# EAGLE design Triac3+ZeroCrossDetector_Module (EAGLE 9.6.2)
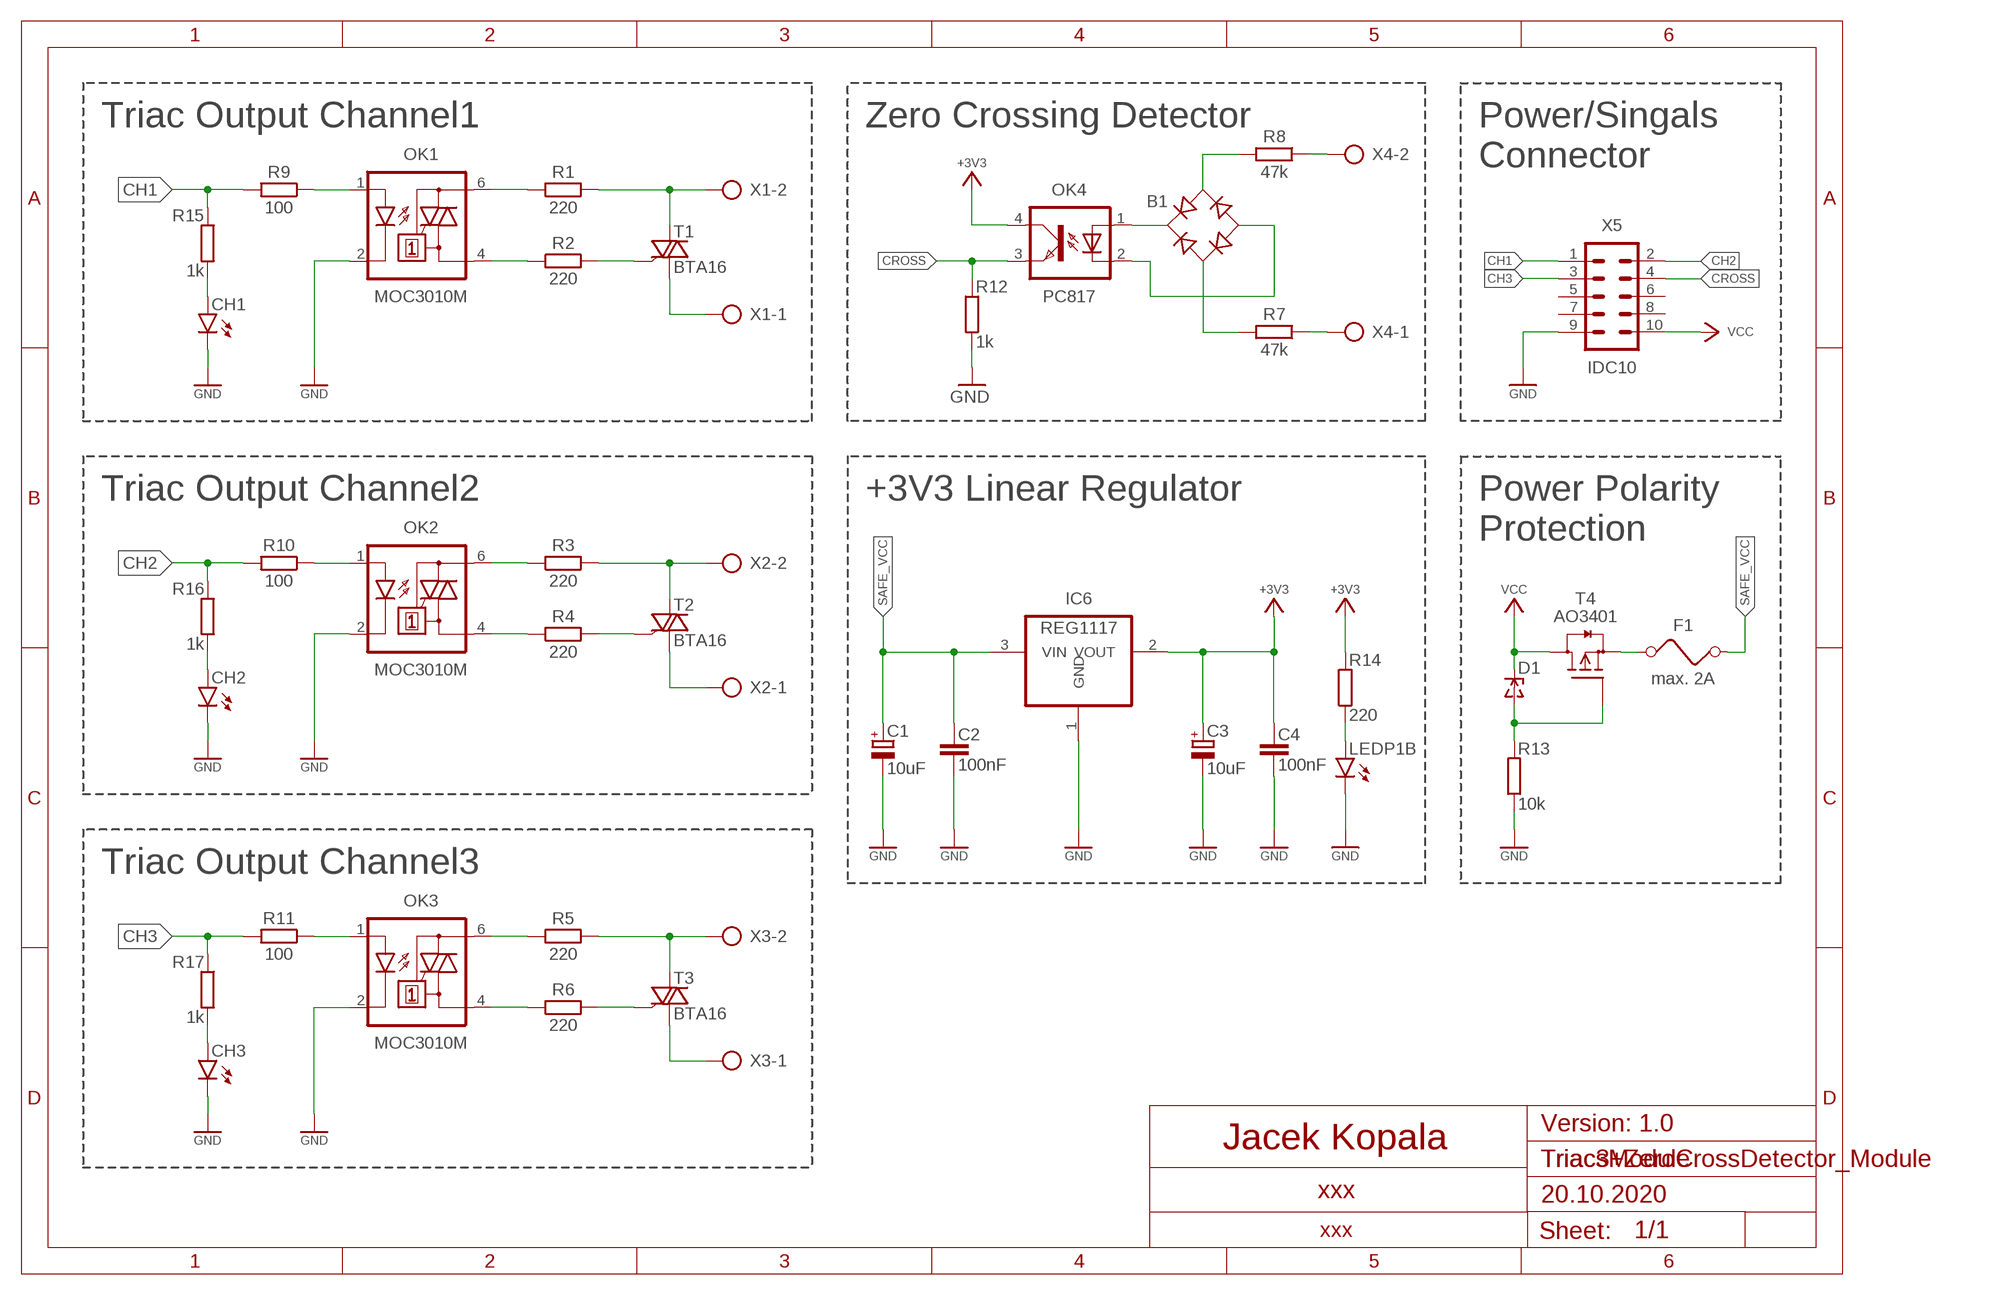
[diagram p0: schematic, sheet 1]

## Parts
B1  RB1A  [RB1A]
C1  10uF  CPOL-EU153CLV-0405  [153CLV-0405]
C2  100nF  C-EUC0805  [C0805]
C3  10uF  CPOL-EU153CLV-0405  [153CLV-0405]
C4  100nF  C-EUC0805  [C0805]
CH1  LEDCHIPLED_0805  [CHIPLED_0805]
CH2  LEDCHIPLED_0805  [CHIPLED_0805]
CH3  LEDCHIPLED_0805  [CHIPLED_0805]
D1  ZENERSOD-323F  [SOD-323F]
F1  max. 2A  FUSEB  [0805]
IC6  REG1117  [SOT223]
LEDP1  LSG-T676  [WL-SFCW-0603]
OK1  MOC3010M  [DIL06]
OK2  MOC3010M  [DIL06]
OK3  MOC3010M  [DIL06]
OK4  PC817  [DIL04]
R1  220  R-EU_0204/7  [0204/7]
R2  220  R-EU_0204/7  [0204/7]
R3  220  R-EU_0204/7  [0204/7]
R4  220  R-EU_0204/7  [0204/7]
R5  220  R-EU_0204/7  [0204/7]
R6  220  R-EU_0204/7  [0204/7]
R7  47k  R-EU_0207/10  [0207/10]
R8  47k  R-EU_0207/10  [0207/10]
R9  100  R-EU_R0805  [R0805]
R10  100  R-EU_R0805  [R0805]
R11  100  R-EU_R0805  [R0805]
R12  1k  R-EU_R0805  [R0805]
R13  10k  R-EU_R0805  [R0805]
R14  220  R-EU_R0805  [R0805]
R15  1k  R-EU_R0805  [R0805]
R16  1k  R-EU_R0805  [R0805]
R17  1k  R-EU_R0805  [R0805]
T1  BTA16  BTA16-V  [TO220BV]
T2  BTA16  BTA16-V  [TO220BV]
T3  BTA16  BTA16-V  [TO220BV]
T4  AO3401  BSS84LT1  [SOT23]
X1  TERMINAL7.5  [TERMINAL7.5]
X2  TERMINAL7.5  [TERMINAL7.5]
X3  TERMINAL7.5  [TERMINAL7.5]
X4  TERMINAL7.5  [TERMINAL7.5]
X5  IDC10  ML10  [ML10]

## Nets
+3V3: C3.+ C4.1 IC6.2(VOUT) OK4.4(COL) R14.2
AC: R1.2 T1.T2(A2) X1.2
AC1: R3.2 T2.T2(A2) X2.2
AC2: R5.2 T3.T2(A2) X3.2
CH1: R9.2 R15.1 X5.1
CH2: R10.2 R16.1 X5.2
CH3: R11.2 R17.1 X5.3
CROSS: OK4.3(EMIT) R12.2 X5.4
GND: C1.- C2.2 C3.- C4.2 CH1.C CH2.C CH3.C IC6.1(GND) LEDP1.P$3(B:C) OK1.2(C) OK2.2(C) OK3.2(C) R12.1 R13.1 X5.9
N$1: B1.AC2 R7.2
N$2: B1.AC1 R8.2
N$3: B1.- OK4.2(C)
N$4: B1.+ OK4.1(A)
N$5: D1.A R13.2 T4.1(G)
N$6: F1.1 T4.2(S)
N$7: R2.2 T1.G
N$8: OK1.1(A) R9.1
N$9: OK1.6(A2) R1.1
N$10: CH1.A R15.2
N$11: T1.T1(A1) X1.1
N$12: OK1.4(A1) R2.1
N$13: CH2.A R16.2
N$14: OK2.1(A) R10.1
N$15: OK2.6(A2) R3.1
N$16: R4.2 T2.G
N$17: T2.T1(A1) X2.1
N$18: OK2.4(A1) R4.1
N$19: CH3.A R17.2
N$20: OK3.1(A) R11.1
N$21: OK3.6(A2) R5.1
N$22: R6.2 T3.G
N$23: T3.T1(A1) X3.1
N$24: OK3.4(A1) R6.1
N$26: R8.1 X4.2
N$27: R7.1 X4.1
N$36: LEDP1.P$4(B:A) R14.1
SAFE_VCC: C1.+ C2.1 F1.2 IC6.3(VIN)
VCC: D1.C T4.3(D) X5.10
Unconnected: LEDP1.P$1(A:C) LEDP1.P$2(A:A) X5.5 X5.6 X5.7 X5.8

## Notes on the sheet
- Triac Output Channel1 | Zero Crossing Detector
- Power/Singals
  Connector
- Triac Output Channel2 | +3V3 Linear Regulator
- Power Polarity
  Protection
- Triac Output Channel3
- Jacek Kopala | Version: 1.0
- TriacsModule
- xxx
- 20.10.2020
- xxx

## Library data of the parts
B1 = rectifier:RB1A: RECTIFIER 1 A
C1 C3 = rcl:CPOL-EU: POLARIZED CAPACITOR, European symbol; SPICEPREFIX: C
C2 C4 = rcl:C-EU: CAPACITOR, European symbol; SPICEPREFIX: C
CH1-CH3 = led:LED: LED OSRAM: - CHIPLED LG R971, LG N971, LY N971, LG Q971, LY Q971, LO R971, LY R971 LH N974, LH R974 LS Q976, LO Q976, LY Q976 LO Q996 - Hyper CHIPLED LW Q18S LB Q993, LB Q99A, LB R99A - SideLED LS A670, LO A670, LY A670, LG A670, LP A670 LB A673, LV A673, LT A673, LW A673 LH A674 LY A675 LS A676, LA A676, LO A676, LY A676, LW A676 LS A679, LY A679, LG A679 - Hyper Micro SIDELED® LS Y876, LA Y876, LO Y876, LY Y876 LT Y87S - SmartLED LW L88C, LW L88S LB L89C, LB L89S, LG L890 LS L89K, LO L89K, LY L89K LS L896, LA L896, LO L896, LY L896 - TOPLED LS T670, LO T670, LY T670, LG T670, LP T670 LSG T670, LSP T670, LSY T670, LOP T670, LYG T670 LG T671, LOG T671, LSG T671 LB T673, LV T673, LT T673, LW T673 LH T674 LS T676, LA T676, LO T676, LY T676, LB T676, LH T676, LSB T676, LW T676 LB T67C, LV T67C, LT T67C, LS T67K, LO T67K, LY T67K, LW E67C LS E67B, LA E67B, LO E67B, LY E67B, LB E67C, LV E67C, LT E67C LW T67C LS T679, LY T679, LG T679 LS T770, LO T770, LY T770, LG T770, LP T770 LB T773, LV T773, LT T773, LW T773 LH T774 LS E675, LA E675, LY E675, LS T675 LS T776, LA T776, LO T776, LY T776, LB T776 LHGB T686 LT T68C, LB T68C - Hyper Mini TOPLED® LB M676 - Mini TOPLED Santana® LG M470 LS M47K, LO M47K, LY M47K Source: http://www.osram.convergy.de LUXEON: - LUMILED® LXK2-PW12-R00, LXK2-PW12-S00, LXK2-PW14-U00, LXK2-PW14-V00 LXK2-PM12-R00, LXK2-PM12-S00, LXK2-PM14-U00 LXK2-PE12-Q00, LXK2-PE12-R00, LXK2-PE12-S00, LXK2-PE14-T00, LXK2-PE14-U00 LXK2-PB12-K00, LXK2-PB12-L00, LXK2-PB12-M00, LXK2-PB14-N00, LXK2-PB14-P00, LXK2-PB14-Q00 LXK2-PR12-L00, LXK2-PR12-M00, LXK2-PR14-Q00, LXK2-PR14-R00 LXK2-PD12-Q00, LXK2-PD12-R00, LXK2-PD12-S00 LXK2-PH12-R00, LXK2-PH12-S00 LXK2-PL12-P00, LXK2-PL12-Q00, LXK2-PL12-R00 Source: www.luxeon.com KINGBRIGHT: KA-3528ASYC Source: www.kingbright.com
D1 = dp_devices.v6:ZENER: Zener Diode SOD-323
F1 = m-pad-2.1:FUSE: Fuse's in various packages
IC6 = burr-brown:REG1117: 800mA and 1A Low Dropout (LDO) Positive Regulator 1.8V, 2.5V, 2.85V, 3.3V, 5V, and Adj; MPN: REG1117; OC_FARNELL: 1097566; OC_NEWARK: 14P6981
LEDP1 = custom_jatsekku:LSG-T676: LSG T676 Hyper Multi TOPLED ® Hyper-Bright LED Source: http://docs-europe.electrocomponents.com/webdocs/08c3/0900766b808c36ca.pdf
OK1-OK3 = optocoupler:MOC30*M: RANDOM-PHASE OPTOISOLATORS TRIAC DRIVER OUTPUT Source: http://www.fairchildsemi.com MOC3020-M.pdf; MF: FAIRCHILD SEMICONDUCTOR; MPN: MOC3010-M; OC_FARNELL: 1505423; OC_NEWARK: 72K8892
OK4 = optocoupler-3-jcn:PC817: SHARP OPTO COUPLER
R1-R17 = rcl:R-EU_: RESISTOR, European symbol; SPICEPREFIX: R
T1-T3 = custom_jatsekku:BTA16: TRIAC Source: http://www.semiconductors.philips.com BT138_SERIES_2.pdf
T4 = m-pad-2.1:BSS84LT1: OnSemi's BSS84LT1 Power MOSFET 130 mA, 50 V RDS(on) = 10 P-Channel SOT-23 Description: These miniature surface mount MOSFETs reduce power loss conserve energy, making this device ideal for use in small power management circuitry. Typical applications are DC/DC converters, load switching, power management in portable and battery-powered products such as computers, printers, cellular and cordless telephones. Features: Energy Efficient Miniature SOT-23 Surface Mount Package Saves Board Space Pb-Free Package is Available Please send any comments to: messi@users.sourceforge.net
X1-X4 = custom_jatsekku_2:TERMINAL7.5: CONNECTOR; OC_FARNELL: unknown; OC_NEWARK: unknown
X5 = con-harting-ml:ML10: HARTING; OC_FARNELL: unknown; OC_NEWARK: unknown

## Board
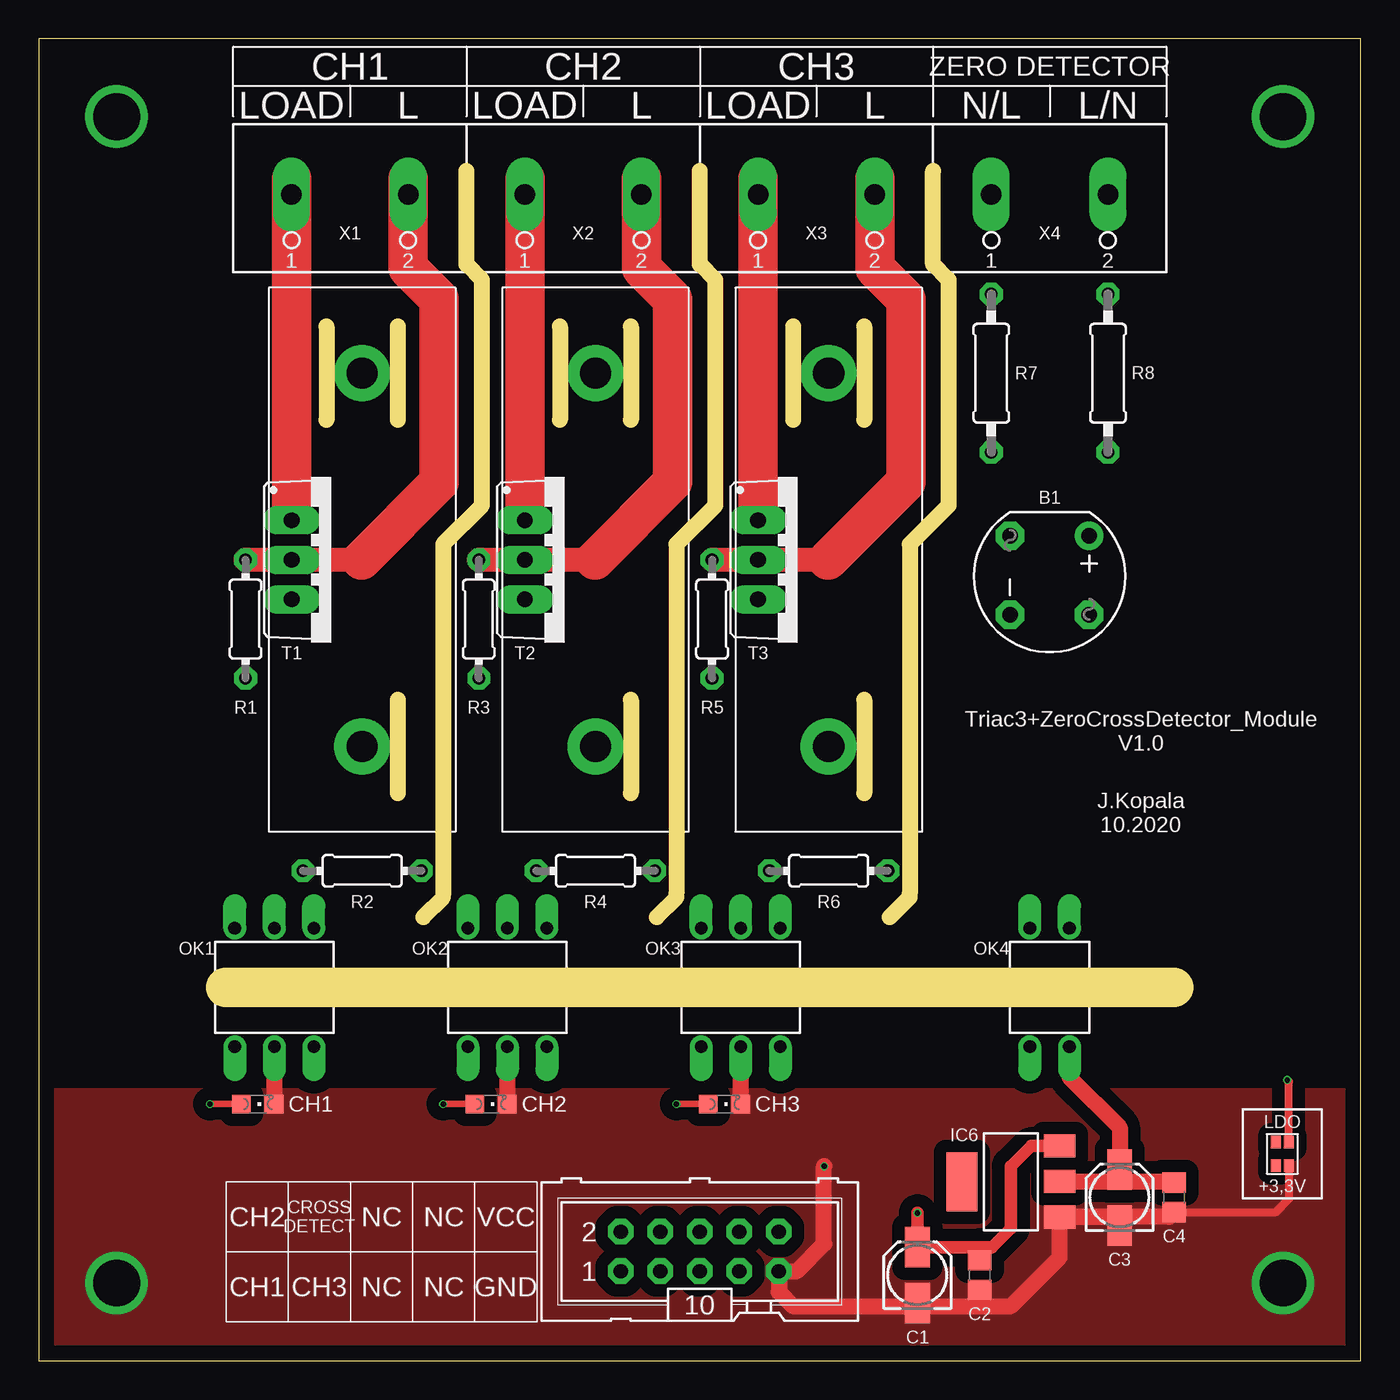
[diagram p1: board, top side]
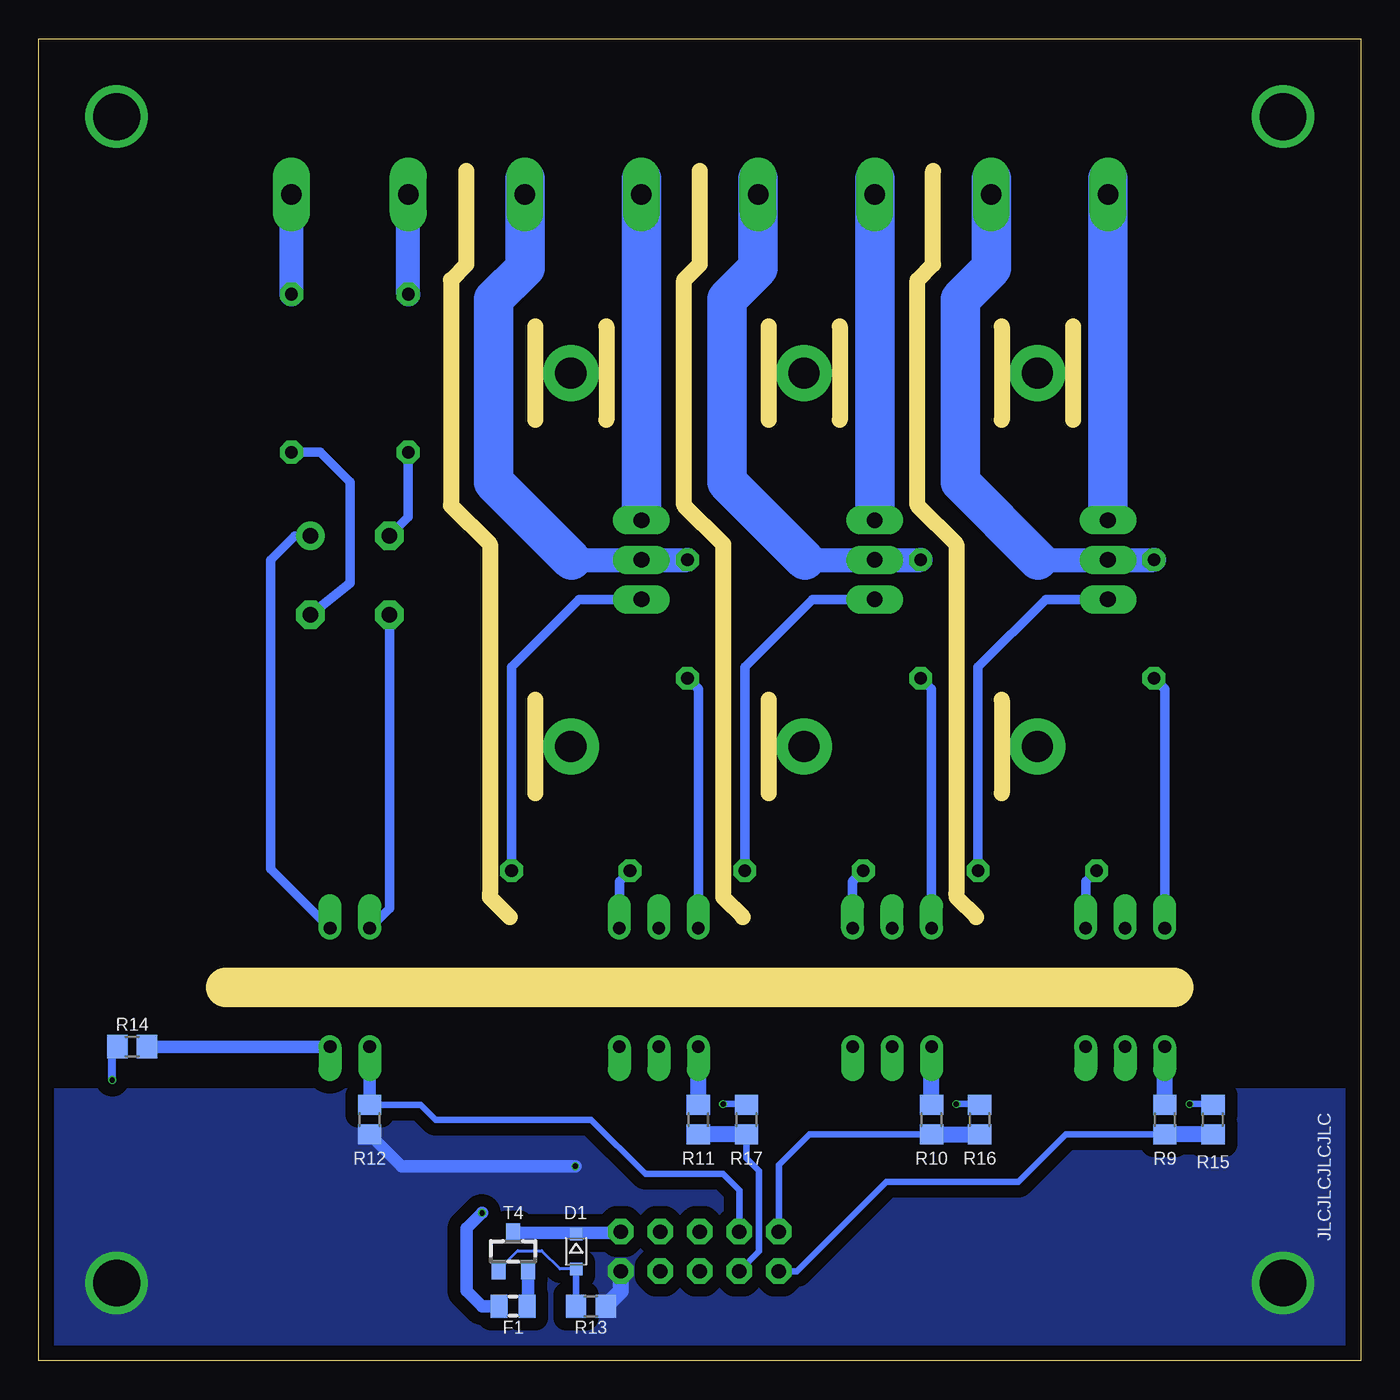
[diagram p2: board, bottom side, seen from below]

Size 85 x 85 mm. Coordinates in mm from the lower left corner, seen from the top.
Outline: 0,0 85,0 85,85 0,85 0,0
Copper layers (1*16): Top 0.035mm / dielectric 1.6mm / Bottom 0.035mm
Design rules "jlcpcb-2layers": minimum track width 5mil, minimum drill 0.3mm, track to track 5mil, track to pad 5mil, pad to pad 5mil, via to via 5mil, smd to smd 5mil, copper to edge 0.2mm, drill to drill 6mil, minimum pad ring 10mil, minimum via ring 3mil, stop-mask expansion 4mil, vias tented up to drill 0mil, thermal gap 10mil
Milling: 28 lines

### Footprints (pad centres in the part's own frame; a part is rotated, then mirrored left to right if it is on the bottom)
RB1A = drill 1.016: + -2.54,2.54 | drill 1.016 octagon: - 2.54,-2.54; AC1 2.54,2.54; AC2 -2.54,-2.54
153CLV-0405 = smd 2.6 x 1.6: + 1.8,0; - -1.8,0
C0805 = smd 1.3 x 1.5: 1 -0.95,0; 2 0.95,0
CHIPLED_0805 = smd 1.2 x 1.2: A 0,-1.05; C 0,1.05
SOD-323F = smd 0.8 x 0.8: A 1.125,0; C -1.125,0
0805 = smd 1.1 x 1.5: 1 -0.9,0; 2 0.9,0
SOT223 = smd 1.499 x 2.007: 1 -2.261,-3.15; 2 0.025,-3.15; 3 2.311,-3.15 | smd 3.81 x 2.007: 4 0,3.15
WL-SFCW-0603 = smd 0.8 x 0.65: P$1 -0.75,0.425; P$2 0.75,0.425; P$3 -0.75,-0.425; P$4 0.75,-0.425
DIL06 = drill 0.813 offset: 1 -2.54,-3.81; 2 0,-3.81; 3 2.54,-3.81; 4 2.54,3.81; 5 0,3.81; 6 -2.54,3.81
DIL04 = drill 0.813 offset: 1 -1.27,-3.81; 2 1.27,-3.81; 3 1.27,3.81; 4 -1.27,3.81
0204/7 = drill 0.813 octagon: 1 -3.81,0; 2 3.81,0
0207/10 = drill 0.813 octagon: 1 -5.08,0; 2 5.08,0
R0805 = smd 1.3 x 1.5: 1 -0.95,0; 2 0.95,0
TO220BV = drill 1.016 long: G 2.54,-4.54; T1 -2.54,-4.54; T2 0,-4.54 | drill 2: P$1 -12,0; P$2 12,0
SOT23 = smd 0.9 x 1.2: 1 -0.95,-1.2; 2 0.95,-1.2; 3 0,1.2
TERMINAL7.5 = drill 1.321 long: 1 -3.75,0; 2 3.75,0
ML10 = drill 0.914 octagon: 1 -5.08,-1.27; 2 -5.08,1.27; 3 -2.54,-1.27; 4 -2.54,1.27; 5 0,-1.27; 6 0,1.27; 7 2.54,-1.27; 8 2.54,1.27; 9 5.08,-1.27; 10 5.08,1.27

### Placement (x,y rotation side)
B1  65,50.5 270 top
C1  56.5,5.5 90 top
C2  60.5,5.5 270 top
C3  69.5,10.5 90 top
C4  73,10.5 270 top
CH1  14.09,16.5 270 top
CH2  29.09,16.5 270 top
CH3  44.09,16.5 270 top
D1  50.45,7.02 270 bottom
F1  54.5,3.5 180 bottom
IC6  62.5,11.5 90 top
LEDP1  79.97,13.29 90 top
OK1  15.14,24 0 top
OK2  30.13,24 0 top
OK3  45.13,24 0 top
OK4  65,24 180 top
R1  13.29,47.69 90 top
R2  20.79,31.5 0 top
R3  28.29,47.69 90 top
R4  35.79,31.5 0 top
R5  43.29,47.69 90 top
R6  50.79,31.5 0 top
R7  61.25,63.5 270 top
R8  68.75,63.5 270 top
R9  12.59,15.5 270 bottom
R10  27.59,15.5 270 bottom
R11  42.59,15.5 270 bottom
R12  63.73,15.5 90 bottom
R13  49.5,3.5 180 bottom
R14  79,20.19 0 bottom
R15  9.5,15.5 90 bottom
R16  24.5,15.5 90 bottom
R17  39.5,15.5 90 bottom
T1  20.79,51.5 270 top
T2  35.79,51.5 270 top
T3  50.79,51.5 270 top
T4  54.5,7.02 0 bottom
X1  20,75 0 top
X2  35,75 0 top
X3  50,75 0 top
X4  65,75 0 top
X5  42.5,7.02 0 top

### Tracks (layer width: path | path; a pad name or v marks a point on that pad's centre or on a via)
+3V3
  Top 0.813: 68.72,11.52 C3.+ | OK4.4 66.27,19.73
  Top 1.016: IC6.2 68.72,11.52 72.92,11.52 C4.1 | OK4.4 66.27,18.23 69.5,15 C3.+
  Bottom 0.813: OK4.4 R14.2
AC
  Top 1.55: 20.75,51.5 T1.T2 | 15.5,51.5 T1.T2 | T1.T2 R1.2
  Top 2.54: 23.75,76 X1.2 23.75,70.25 25.75,68.25 25.75,56.5 20.75,51.5
AC1
  Top 1.55: 35.75,51.5 T2.T2 | 30.5,51.5 T2.T2 | T2.T2 R3.2
  Top 2.54: 38.75,76 X2.2 38.75,70.24 40.75,68.25 40.75,56.5 35.75,51.5
AC2
  Top 1.55: 50.75,51.5 T3.T2 | 45.5,51.5 T3.T2 | T3.T2 R5.2
  Top 2.54: 53.75,76 X3.2 53.75,70.25 55.75,68.25 55.75,56.5 50.75,51.5
AC4
  Bottom 1.55: 20.75,51.5 13.29,51.5
  Bottom 2.54: 23.75,76 23.75,70.25 25.75,68.25 25.75,56.5 20.75,51.5
AC5
  Bottom 1.55: 35.75,51.5 28.29,51.5
  Bottom 2.54: 38.75,76 38.75,70.24 40.75,68.25 40.75,56.5 35.75,51.5
AC6
  Bottom 1.55: 50.75,51.5 43.29,51.5
  Bottom 2.54: 53.75,76 53.75,70.25 55.75,68.25 55.75,56.5 50.75,51.5
CH1
  Bottom 0.406: X5.1 36.25,5.75 30.5,11.5 22,11.5 18.95,14.55 R9.2
  Bottom 1.016: R15.1 R9.2
CH2
  Bottom 0.406: X5.2 37.42,12.58 35.45,14.55 R10.2
  Bottom 1.016: R10.2 R16.1
CH3
  Bottom 0.406: X5.3 38.69,7.02 38.69,12.19 39.5,13 R17.1
  Bottom 1.016: R17.1 R11.2
CROSS
  Bottom 0.406: X5.4 39.96,10.96 41,12 46,12 49.5,15.5 59.5,15.5 60.45,16.45 R12.2
  Bottom 0.813: R12.2 OK4.3
GND  (via drill 0.35, 3 pad 4.02)
  Top 0.406: 45.15,20.18 OK3.2
  Top 0.508: LEDP1.P$3 80.39,10.39 79.55,9.55 C4.2 | 69.7,8.5 C3.-
  Top 0.813: C1.- 56.7,3.5 | C2.2 60.5,3.5 | 68.96,9.24 C3.-
  Top 1.016: IC6.1 65.65,6.65 62.5,3.5 60.5,3.5 56.7,3.5 48.5,3.5 47.58,4.42 X5.9 48.75,5.75 50.5,7.5 v50.5,12.5 | IC6.1 68.96,9.24 | C4.2 72.69,9.24 IC6.1 | OK1.2 CH1.C | CH2.C OK2.2 | CH3.C 45.15,20.18
  Bottom 0.813: R12.1 61.68,12.5 v50.5,12.5
  Bottom 1.016: X5.9 47.58,4.47 R13.1
  other vias: 5,5 80,5
  pour Bottom (isolate 0.813, no thermals): 1,1 1,17.5 84,17.5 84,1
  pour Top (isolate 0.813, no thermals): 1,17.5 1,1 84,1 84,17.5
N$1
  Bottom 0.61: R7.2 61.25,54.25 B1.AC2
N$2
  Bottom 0.61: B1.AC1 65,50 65,56.5 66.92,58.42 R8.2
N$3
  Bottom 0.61: OK4.2 62.46,29.08 B1.-
N$4
  Bottom 0.61: B1.+ 68.54,53.04 70.08,51.5 70.08,31.62 OK4.1
N$5
  Bottom 0.2: T4.1 54.2,7.07 52.66,7.07 51.49,5.89 D1.A
  Bottom 0.406: D1.A R13.2
N$6
  Bottom 0.813: T4.2 53.55,3.55 F1.1
N$7
  Bottom 0.61: T1.G 20.25,48.96 24.6,44.61 R2.2
N$8
  Bottom 1.016: R9.1 OK1.1
N$9
  Bottom 0.61: OK1.6 12.59,43.19 R1.1
N$10  (via drill 0.35)
  Top 0.406: CH1.A v11,16.5
  Bottom 0.406: R15.2 9.55,16.5 v11,16.5
N$11
  Top 1.016: T1.T1 16.25,54.6
  Top 2.54: 16.25,54.6 X1.1 16.25,76
N$12
  Bottom 0.61: R2.1 17.68,30.8 OK1.4
N$13  (via drill 0.35)
  Top 0.406: CH2.A v26,16.5
  Bottom 0.406: v26,16.5 24.55,16.5 R16.2
N$14
  Bottom 1.016: R10.1 OK2.1
N$15
  Bottom 0.61: OK2.6 27.59,43.19 R3.1
N$16
  Bottom 0.61: T2.G 35.25,48.96 39.6,44.61 R4.2
N$17
  Top 1.016: T2.T1 31.25,54.6
  Top 2.54: 31.25,54.6 X2.1 31.25,76
N$18
  Bottom 0.61: OK2.4 32.67,30.8 R4.1
N$19  (via drill 0.35)
  Top 0.406: CH3.A v41,16.5
  Bottom 0.406: v41,16.5 39.55,16.5 R17.2
N$20
  Bottom 1.016: R11.1 OK3.1
N$21
  Bottom 0.61: OK3.6 42.59,43.19 R5.1
N$22
  Bottom 0.61: T3.G 50.25,48.96 54.6,44.61 R6.2
N$23
  Top 1.016: T3.T1 46.25,54.6
  Top 2.54: 46.25,54.6 X3.1 46.25,76
N$24
  Bottom 0.61: OK3.4 47.67,30.8 R6.1
N$26
  Bottom 1.55: R8.1 X4.2
N$27
  Bottom 1.55: R7.1 X4.1
N$28  (via drill 3 pad 4.02)
  other vias: 80,80
N$29  (via drill 3 pad 4.02)
  other vias: 5,80
N$32
  Bottom 1.016: 16.25,54.04 16.25,54.6
  Bottom 2.54: 16.25,54.6 16.25,76
N$33
  Bottom 1.016: 31.25,54.04 31.25,54.6
  Bottom 2.54: 31.25,54.6 31.25,76
N$34
  Bottom 1.016: 46.25,54.04 46.25,54.6
  Bottom 2.54: 46.25,54.6 46.25,76
N$36  (via drill 0.35)
  Top 0.508: LEDP1.P$4 80.39,17.95 v80.28,18.05
  Bottom 0.508: v80.28,18.05 80.28,20.06 R14.1
SAFE_VCC  (via drill 0.35)
  Top 0.813: v56.5,9.5 C1.+ 60.5,7.3 | IC6.3 63.81,13.81 62.5,12.5 62.5,8.5 61.3,7.3 60.5,7.3 | C2.1 60.5,7.3
  Bottom 0.813: F1.2 56.5,3.5 57.5,4.5 57.5,8.5 v56.5,9.5
VCC
  Bottom 0.406: 50.3,8.29 D1.C 50.52,8.22
  Bottom 0.813: T4.3 50.52,8.22 47.65,8.22 X5.10

### Text on the board
tPlace: CH1 | CH2 | CH3 | ZERO DETECTOR | LOAD | L | LOAD | L | LOAD | L | N/L | L/N | Triac3+ZeroCrossDetector_Module / V1.0 | J.Kopala / 10.2020 | LDO | +3,3V | CH2 | CROSS / DETECT | NC | NC | VCC | CH1 | CH3 | NC | NC | GND
bPlace: JLCJLCJLCJLC